# EAGLE schematic DoorBell (EAGLE 7.2.0)
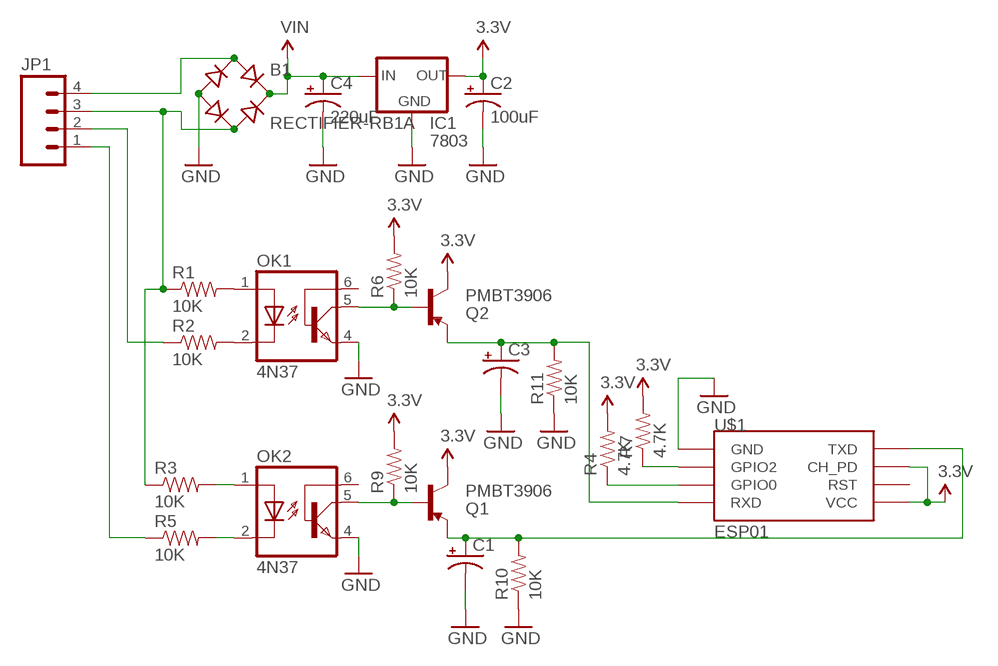
[diagram p0: schematic, sheet 1]

## Parts
B1  RECTIFIER-RB1A  [RB1A]
C1  CAP_POLPTH2  [CPOL-RADIAL-10UF-25V]
C2  100uF  CAP_POLPTH2  [CPOL-RADIAL-10UF-25V]
C3  CAP_POLPTH2  [CPOL-RADIAL-10UF-25V]
C4  220uF  CAP_POLPTH3  [CPOL-RADIAL-1000UF-63V]
IC1  7803  V_REG_78XX-TO-220  [TO-220-ALT]
JP1  M04SCREW  [SCREWTERMINAL-3.5MM-4]
OK1  4N37  [DIL06]
OK2  4N37  [DIL06]
Q1  PMBT3906  TRANSISTOR_PNPPMBT3906  [SOT23-3]
Q2  PMBT3906  TRANSISTOR_PNPPMBT3906  [SOT23-3]
R1  10K  RESISTORPTH-1/4W-VERT  [AXIAL-0.1]
R2  10K  RESISTORPTH-1/4W-VERT  [AXIAL-0.1]
R3  10K  RESISTORPTH-1/4W-VERT  [AXIAL-0.1]
R4  4.7K  RESISTOREZ  [AXIAL-0.3EZ]
R5  10K  RESISTORPTH-1/4W-VERT  [AXIAL-0.1]
R6  10K  RESISTORPTH-1/4W-VERT  [AXIAL-0.1]
R7  4.7K  RESISTOREZ  [AXIAL-0.3EZ]
R9  10K  RESISTORPTH-1/4W-VERT  [AXIAL-0.1]
R10  10K  RESISTORPTH-1/4W-VERT  [AXIAL-0.1]
R11  10K  RESISTORPTH-1/4W-VERT  [AXIAL-0.1]
U$1  ESP01  [ESP01]

## Nets
3.3V [power]: C2.1(+) IC1.OUT Q1.3(C) Q2.3(C) R4.P$2 R6.P$2 R7.P$2 R9.P$2 U$1.CH_PD U$1.VCC
GND [power]: B1.- C1.2(-) C2.2(-) C3.2(-) C4.2(-) IC1.GND OK1.4(EMI) OK2.4(EMI) R10.P$1 R11.P$1 U$1.GND
N$1 [power]: B1.AC1 JP1.4
N$2 [power]: B1.AC2 JP1.3 R1.P$1 R3.P$1
N$3: OK1.1(A) R1.P$2
N$4: OK1.2(C) R2.P$2
N$5: OK2.1(A) R3.P$2
N$6: OK2.2(C) R5.P$2
N$8: OK1.5(COL) Q2.1(B) R6.P$1
N$9: OK2.5(COL) Q1.1(B) R9.P$1
N$10: C3.1(+) Q2.2(E) R11.P$2 U$1.RX(RXD)
N$11: JP1.2 R2.P$1
N$12: R7.P$1 U$1.GPIO2
N$13: C1.1(+) Q1.2(E) R10.P$2 U$1.TX(TXD)
N$14: JP1.1 R5.P$1
N$15: R4.P$1 U$1.GPIO0
VIN [power]: B1.+ C4.1(+) IC1.IN
Unconnected: OK1.6(BAS) OK2.6(BAS) U$1.RST

## Library data of the parts
B1 = rectifier:RECTIFIER-: Rectifier
C1-C4 = SparkFun-Capacitors:CAP_POL: Capacitor Polarized These are standard SMD and PTH capacitors. Normally 10uF, 47uF, and 100uF in electrolytic and tantalum varieties. Always verify the external diameter of the through hole cap, it varies with capacity, voltage, and manufacturer. The EIA devices should be standard.
IC1 = SparkFun-PowerIC:V_REG_78XX: Voltage Regulator Standard 78xx regulator. IGO (Input Ground Output). Spark Fun Electronics SKU : COM-00107
JP1 = SparkFun-Connectors:M04: Header 4 Standard 4-pin 0.1" header. Use with straight break away headers (SKU : PRT-00116), right angle break away headers (PRT-00553), swiss pins (PRT-00743), machine pins (PRT-00117), and female headers (PRT-00115). Molex polarized connector foot print use with SKU : PRT-08231 with associated crimp pins and housings. 1MM SMD Version SKU: PRT-10208
OK1 OK2 = optocoupler:4N37: OPTO COUPLER Source: http://www.fairchildsemi.com/pf/4N/4N35-M.html; MF: FAIRCHILD SEMICONDUCTOR; MPN: 4N37; OC_FARNELL: 1612456; OC_NEWARK: 72K9948
Q1 Q2 = SparkFun-DiscreteSemi:TRANSISTOR_PNP: Generic PNP BJT Double check pinouts against datasheets- not all devices are the same! MMBT3906 - 40V 200mA SOT-23 (TRANS-08052) MMBT4403 - 40V 600mA SOT-23 (TRANS-09245); PROD_ID: TRANS-08052
R1-R7 R9-R11 = SparkFun-Resistors:RESISTOR: Resistor Basic schematic elements and footprints for 0603, 1206, and PTH resistors.
U$1 = esp8266modules:ESP01: ESP8266 Wifi module 01

## Net classes
0 default: width 0.305 mm
1 power: width 0.813 mm, clearance 0.406 mm